# Altium project Multi-Effect_Interface.PrjPcb
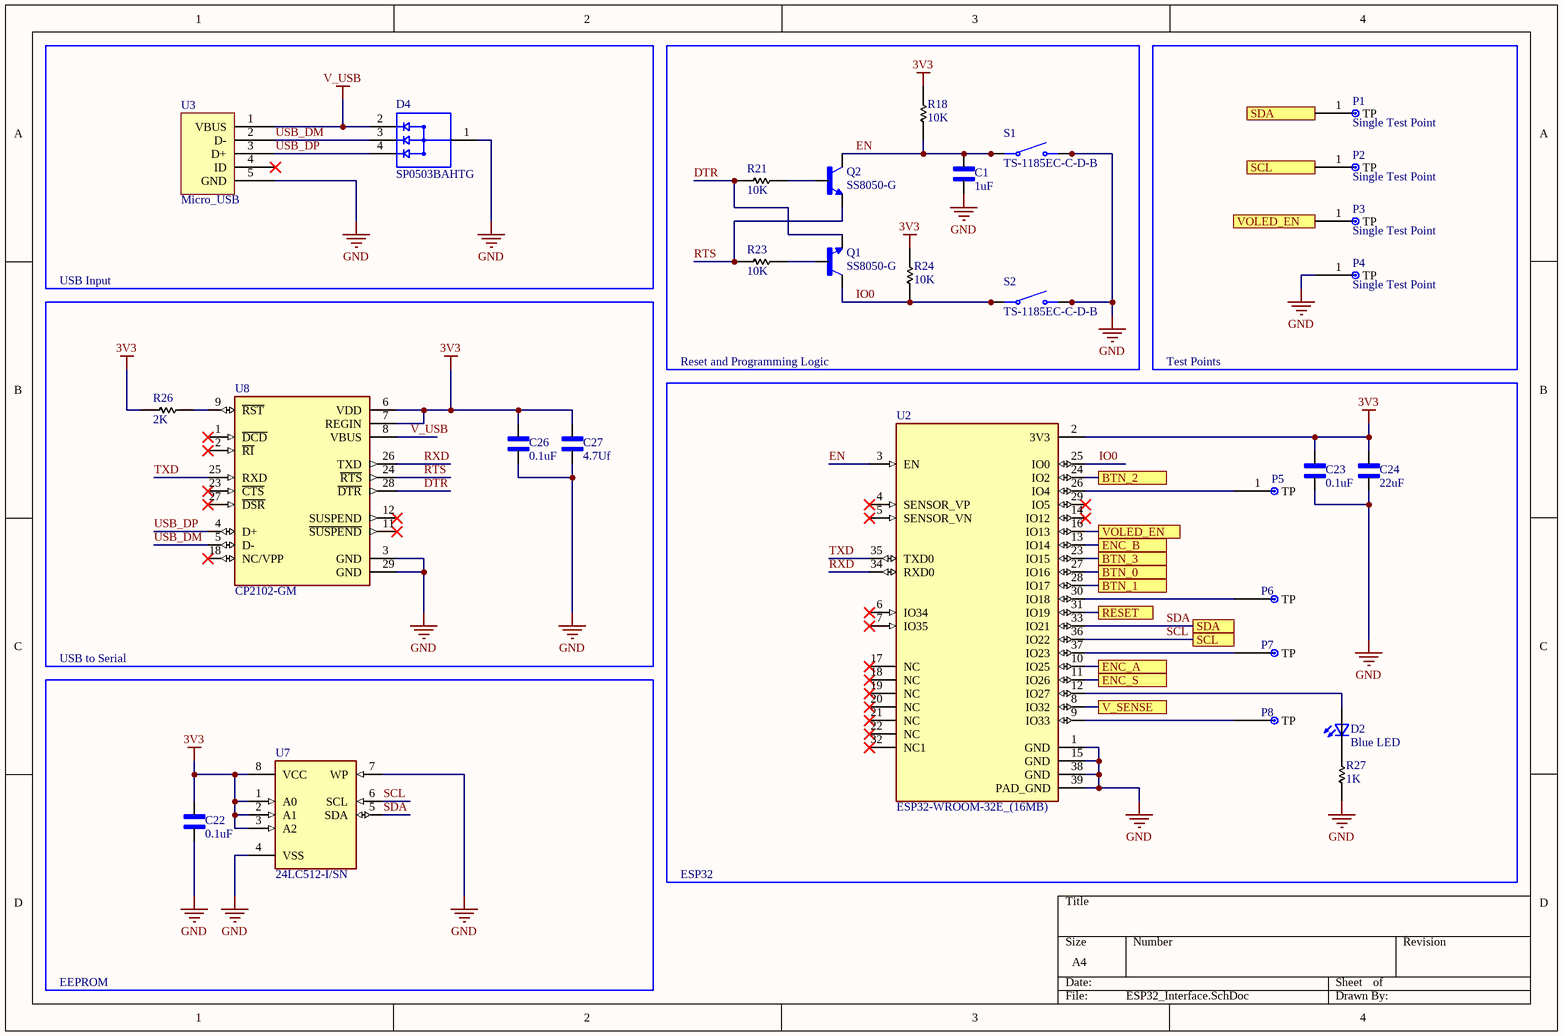
[diagram p0: ESP32_Interface.SchDoc]
4 sheets, 85 parts. Net scope: flat (ports and power ports of the same name join across sheets).
Board file: Interface_PCB.PcbDoc
Sheets:
  ESP32_Interface.SchDoc
  IO.SchDoc
  OLED.SchDoc
  Power.SchDoc

## Sheet ESP32_Interface.SchDoc
size A4; SheetNumber: 1; SheetTotal: 4

### Parts
C1  1uF  [CHIP_0603]
C22  0.1uF  [CHIP_0603]
C23  0.1uF  [CHIP_0603]
C24  22uF  [CHIP_0603]
C26  0.1uF  [CHIP_0603]
C27  4.7Uf  [CHIP_0603]
D2  Blue LED  [0603 LED Generic]
D4  SP0503BAHTG  [SP0503BAHTG]
P1  Single Test Point  [1 Solder Pad]
P2  Single Test Point  [1 Solder Pad]
P3  Single Test Point  [1 Solder Pad]
P4  Single Test Point  [1 Solder Pad]
P5  Single Test Point  [1 Solder Pad]  (value not drawn)
P6  Single Test Point  [1 Solder Pad]  (value not drawn)
P7  Single Test Point  [1 Solder Pad]  (value not drawn)
P8  Single Test Point  [1 Solder Pad]  (value not drawn)
Q1  SS8050-G  [SS8050-G]
Q2  SS8050-G  [SS8050-G]
R18  10K  [CHIP_R_0603]
R21  10K  [CHIP_R_0603]
R23  10K  [CHIP_R_0603]
R24  10K  [CHIP_R_0603]
R26  2K  [CHIP_R_0603]
R27  1K  [CHIP_R_0603]
S1  TS-1185EC-C-D-B  [TS-1185EC-C-D-B]
S2  TS-1185EC-C-D-B  [TS-1185EC-C-D-B]
U2  ESP32-WROOM-32E_(16MB)  [MODULE_ESP32-WROOM-32E]
U3  Micro_USB  [U254-051T-4BH83-F1S]
U7  24LC512-I/SN  [24LC512-I/SN]
U8  CP2102-GM  [QFN50P500X500X100-29N]

### Blocks framed on the sheet
USB Input: D4 U3
Reset and Programming Logic: C1 Q1 Q2 R18 R21 R23 R24 S1 S2
Test Points: P1-P4
USB to Serial: C26 C27 R26 U8
ESP32: C23 C24 D2 P5-P8 R27 U2

### Ports
BTN_0, BTN_1, BTN_2, BTN_3, ENC_A, ENC_B, ENC_S, RESET, SCL, SDA, V_SENSE, VOLED_EN

### Nets
3V3: C22.1 C23.1 C24.1 C26.1 C27.1 R18.1 R24.1 R26.2 U2.2(3V3) U7.1(A0) U7.2(A1) U7.3(A2) U7.8(VCC) U8.6(VDD) U8.7(REGIN)
GND: C1.2 C22.2 C23.2 C24.2 C26.2 C27.2 D4.1 P4.1(TP) R27.2 S1.3(NO) S1.4(NO) S2.3(NO) S2.4(NO) U2.1(GND) U2.15(GND) U2.38(GND) U2.39(PAD_GND) U3.5(GND) U7.4(VSS) U7.7(WP) U8.3(GND) U8.29(GND)
V_USB: D4.2 U3.1(VBUS) U8.8(VBUS)
DTR: Q1.2(E) R21.2 U8.28(~{DTR})
EN: C1.1 Q2.3(C) R18.2 S1.1(COM) S1.2(COM) U2.3(EN)
IO0: Q1.3(C) R24.2 S2.1(COM) S2.2(COM) U2.25(IO0)
RTS: Q2.2(E) R23.2 U8.24(~{RTS})
RXD: U2.34(RXD0) U8.26(TXD)
SCL: P2.1(TP) U2.36(IO22) U7.6(SCL) ; port SCL
SDA: P1.1(TP) U2.33(IO21) U7.5(SDA) ; port SDA
TXD: U2.35(TXD0) U8.25(RXD)
USB_DM: D4.3 U3.2(D-) U8.5(D-)
USB_DP: D4.4 U3.3(D+) U8.4(D+)
NetC2_1: U2.27(IO16) ; port BTN_0
NetC3_1: U2.28(IO17) ; port BTN_1
NetC4_1: U2.11(IO26) ; port ENC_S
NetC5_1: U2.13(IO14) ; port ENC_B
NetC6_1: U2.10(IO25) ; port ENC_A
NetC7_1: U2.24(IO2) ; port BTN_2
NetC8_1: U2.23(IO15) ; port BTN_3
NetD2_1: D2.1(K2) R27.1
NetD2_2: D2.2(A2) U2.12(IO27)
NetJ1_9: U2.31(IO19) ; port RESET
NetP3_1: P3.1(TP) U2.16(IO13) ; port VOLED_EN
NetP5_1: P5.1(TP) U2.26(IO4)
NetP6_1: P6.1(TP) U2.30(IO18)
NetP7_1: P7.1(TP) U2.37(IO23)
NetP8_1: P8.1(TP) U2.9(IO33)
NetQ1_1: Q1.1(B) R23.1
NetQ2_1: Q2.1(B) R21.1
NetR14_2: U2.8(IO32) ; port V_SENSE
NetR26_1: R26.1 U8.9(~{RST})

Not connected (* = marked no-connect by the designer): U2 4(SENSOR_VP)* 5(SENSOR_VN)* 6(IO34)* 7(IO35)* 14(IO12)* 17(NC)* 18(NC)* 19(NC)* 20(NC)* 21(NC)* 22(NC)* 29(IO5)* 32(NC1)*; U3 4(ID)*; U8 1(~{DCD})* 2(~{RI})* 11(~{SUSPEND})* 12(SUSPEND)* 18(NC/VPP)* 23(~{CTS})* 27(~{DSR})*

### Notes on the sheet
- EEPROM

### Library data of the parts
C1 C22-C24 C26 C27 = 0603 Ceramic Capacitor: Generic 0603 Ceramic Capacitor; MP: AC0402FR-071ML; MF: Yageo; Package: 1005 Yageo; SnapEDA_Link: https://www.snapeda.com/parts/AC0402FR-071ML/Yageo/view-part/940461/?ref=snap; Value: *; Mouser-Purchase-URL: https://snapeda.com/shop?store=Mouser&id=940461; DigiKey-Purchase-URL: https://snapeda.com/shop?store=DigiKey&id=940461
D2 = 0603 Generic LED: Value: *
D4 = SP0503BAHTG: 8.5V Clamp Ipp Tvs Diode Surface Mount SOT-143-4; MF: Littelfuse Inc.; MP: SP0503BAHTG; Package: SOT-143 Littelfuse; SnapEDA_Link: https://www.snapeda.com/parts/SP0503BAHTG/Littelfuse%20Inc./view-part/214427/?ref=snap; Digi-Key_Purchase_URL: https://www.digikey.com/product-detail/en/littelfuse-inc/SP0503BAHTG/F2715CT-ND/1154322?utm_source=snapeda&utm_medium=aggregator&utm_campaign=symbol; Value: *; Digi-Key_Part_Number: F2715CT-ND
Q1 Q2 = SS8050-G: NPN TRANSISTOR 1.5A 40V SOT-23 R
R18 R21 R23 R24 R26 R27 = 0603 Generic Resistor: Generic 0603 Resistor
S1 S2 = TS-1185EC-C-D-B: SMD Tactile Switche - 3mm 2mm 50mA 3.65mm SPST 12V
U2 = ESP32-WROOM-32E_(16MB): Bluetooth, WiFi 802.11b/g/n, Bluetooth v4.2 +EDR, Class 1, 2 and 3 Transceiver Module 2.4GHz ~ 2.5GHz Integrated, Trace Surface Mount; MP: ESP32-WROOM-32E (16MB); MF: Espressif Systems; Value: *; SnapEDA_Link: https://www.snapeda.com/parts/ESP32-WROOM-32E%20(16MB)/Espressif%20Systems/view-part/4792564/?ref=snap; Check_prices: https://www.snapeda.com/parts/ESP32-WROOM-32E%20(16MB)/Espressif%20Systems/view-part/4792564/?ref=eda; Availability: Unavailable; Price: None; Package: None
U3 = Micro_USB: XKB Connectivity U254-051T-4BH83-F1S
U7 = 24LC512-I/SN: 512K I2C Serial EEPROM
U8 = CP2102-GM: USB Bridge, USB to UART USB 2.0 UART Interface 28-QFN _5x5_; MF: Silicon Labs; Package: QFN-28 Silicon Labs; Value: *; Price: None; MP: CP2102-GM; Availability: Unavailable; SnapEDA_Link: https://www.snapeda.com/parts/CP2102-GM/Silicon%20Labs/view-part/135876/?ref=snap

## Sheet IO.SchDoc
size A4; SheetNumber: 2; SheetTotal: 4
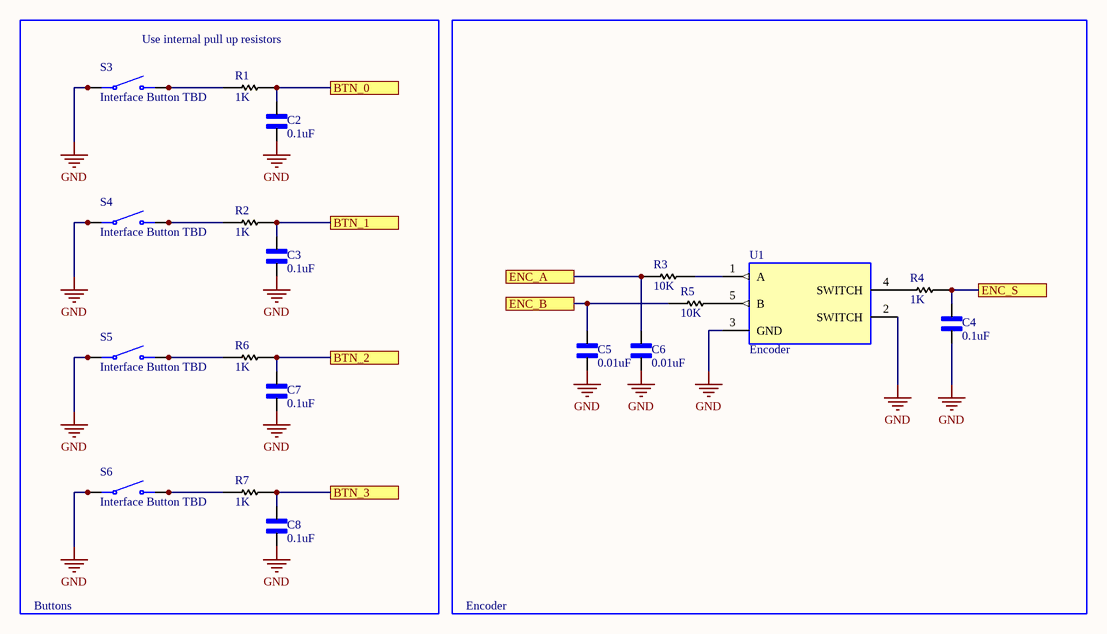
[diagram p1: IO.SchDoc]

### Parts
C2  0.1uF  [CHIP_0603]
C3  0.1uF  [CHIP_0603]
C4  0.1uF  [CHIP_0603]
C5  0.01uF  [CHIP_0603]
C6  0.01uF  [CHIP_0603]
C7  0.1uF  [CHIP_0603]
C8  0.1uF  [CHIP_0603]
R1  1K  [CHIP_R_0603]
R2  1K  [CHIP_R_0603]
R3  10K  [CHIP_R_0603]
R4  1K  [CHIP_R_0603]
R5  10K  [CHIP_R_0603]
R6  1K  [CHIP_R_0603]
R7  1K  [CHIP_R_0603]
S3  Interface Button TBD  [Interface_Button_Multi_Footprint]
S4  Interface Button TBD  [Interface_Button_Multi_Footprint]
S5  Interface Button TBD  [Interface_Button_Multi_Footprint]
S6  Interface Button TBD  [Interface_Button_Multi_Footprint]
U1  Encoder  [Encoder Solder Pads]

### Blocks framed on the sheet
Encoder: C4-C6 R3-R5 U1

### Ports
BTN_0, BTN_1, BTN_2, BTN_3, ENC_A, ENC_B, ENC_S

### Nets
GND: C2.2 C3.2 C4.2 C5.2 C6.2 C7.2 C8.2 S3.1(COM) S3.2(COM) S4.1(COM) S4.2(COM) S5.1(COM) S5.2(COM) S6.1(COM) S6.2(COM) U1.2(SWITCH) U1.3(GND)
NetC2_1: C2.1 R1.1 ; port BTN_0
NetC3_1: C3.1 R2.1 ; port BTN_1
NetC4_1: C4.1 R4.1 ; port ENC_S
NetC5_1: C5.1 R5.2 ; port ENC_B
NetC6_1: C6.1 R3.2 ; port ENC_A
NetC7_1: C7.1 R6.1 ; port BTN_2
NetC8_1: C8.1 R7.1 ; port BTN_3
NetR1_2: R1.2 S3.3(NO) S3.4(NO)
NetR2_2: R2.2 S4.3(NO) S4.4(NO)
NetR3_1: R3.1 U1.1(A)
NetR4_2: R4.2 U1.4(SWITCH)
NetR5_1: R5.1 U1.5(B)
NetR6_2: R6.2 S5.3(NO) S5.4(NO)
NetR7_2: R7.2 S6.3(NO) S6.4(NO)

### Notes on the sheet
- Use internal pull up resistors
- Buttons

### Library data of the parts
C2-C8 = 0603 Ceramic Capacitor: as C1 on sheet ESP32_Interface; Package: 1005 Yageo; SnapEDA_Link: https://www.snapeda.com/parts/AC0402FR-071ML/Yageo/view-part/940461/?ref=snap; Value: *; Mouser-Purchase-URL: https://snapeda.com/shop?store=Mouser&id=940461; DigiKey-Purchase-URL: https://snapeda.com/shop?store=DigiKey&id=940461
R1-R7 = 0603 Generic Resistor: Generic 0603 Resistor
S3-S6 = Interface Button TBD: TBD
U1 = Encoder: Encoder solder connections for PEC11R-4215F-S0024; MF: Diodes Inc.; MP: AP3012KTR-G1; Package: SOT-23-5 Diodes Inc.; Value: *; Availability: Unavailable; SnapEDA_Link: https://www.snapeda.com/parts/AP3012KTR-G1/Diodes%20Inc./view-part/587030/?ref=snap; Price: None

## Sheet OLED.SchDoc
size A4; SheetNumber: 3; SheetTotal: 4
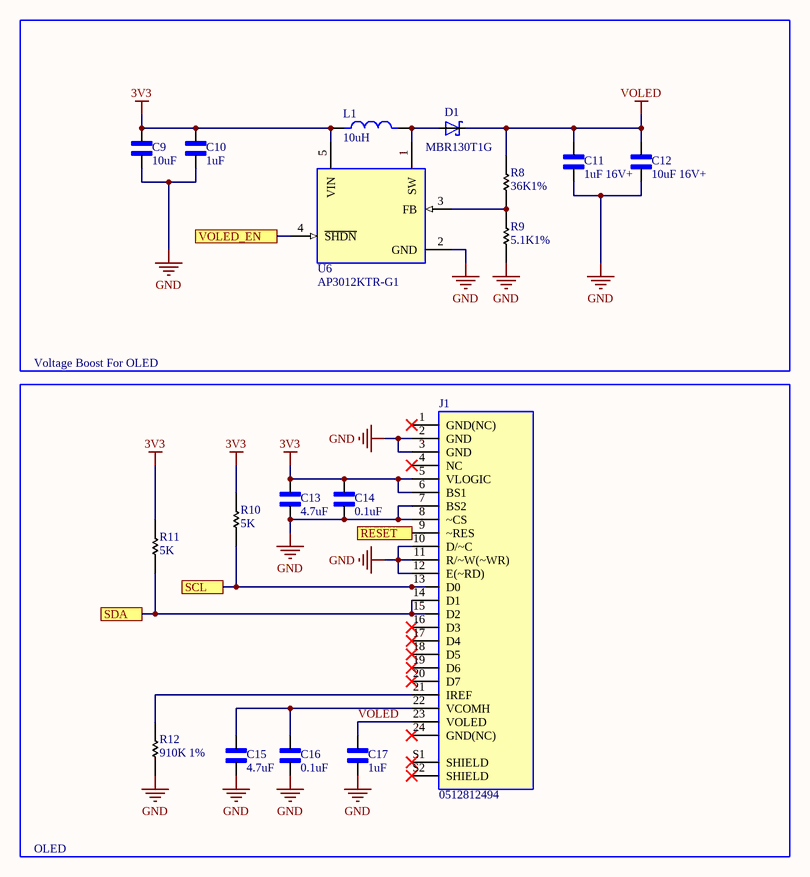
[diagram p2: OLED.SchDoc]

### Parts
C9  10uF  [CHIP_0603]
C10  1uF  [CHIP_0603]
C11  1uF 16V+  [CHIP_0603]
C12  10uF 16V+  [CHIP_0603]
C13  4.7uF  [CHIP_0603]
C14  0.1uF  [CHIP_0603]
C15  4.7uF  [CHIP_0603]
C16  0.1uF  [CHIP_0603]
C17  1uF  [CHIP_0603]
D1  MBR130T1G  [SOD-123-2]
J1  0512812494  [Top_Connector_Config_0512812494]
L1  10uH  [IND_LQH3NPZ100MMEL]
R8  36K1%  [CHIP_R_0603]
R9  5.1K1%  [CHIP_R_0603]
R10  5K  [CHIP_R_0603]
R11  5K  [CHIP_R_0603]
R12  910K 1%  [CHIP_R_0603]
U6  AP3012KTR-G1  [SOT-23]

### Blocks framed on the sheet
Voltage Boost For OLED: C9-C12 D1 L1 R8 R9 U6
OLED: C13-C17 J1 R10-R12

### Ports
RESET, SCL, SDA, VOLED_EN

### Nets
3V3: C9.1 C10.1 C13.1 C14.1 J1.5(VLOGIC) J1.6(BS1) L1.1 R10.1 R11.1 U6.5(VIN)
GND: C9.2 C10.2 C11.2 C12.2 C13.2 C14.2 C15.2 C16.2 C17.2 J1.2(GND) J1.3(GND) J1.7(BS2) J1.8(~CS) J1.10(D/~C) J1.11(R/~W(~WR)) J1.12(E(~RD)) R9.2 R12.2 U6.2(GND)
VOLED: C11.1 C12.1 C17.1 D1.C J1.23(VOLED) R8.1
SCL: J1.13(D0) R10.2 ; port SCL
SDA: J1.14(D1) J1.15(D2) R11.2 ; port SDA
NetC15_1: C15.1 C16.1 J1.22(VCOMH)
NetD1_A: D1.A L1.2 U6.1(SW)
NetJ1_9: J1.9(~RES) ; port RESET
NetJ1_21: J1.21(IREF) R12.1
NetP3_1: U6.4(~{SHDN}) ; port VOLED_EN
NetR8_2: R8.2 R9.1 U6.3(FB)

Not connected (* = marked no-connect by the designer): J1 1(GND(NC))* 4(NC)* 16(D3)* 17(D4)* 18(D5)* 19(D6)* 20(D7)* 24(GND(NC))* S1(SHIELD)* S2(SHIELD)*

### Library data of the parts
C9-C17 = 0603 Ceramic Capacitor: as C1 on sheet ESP32_Interface; Package: 1005 Yageo; SnapEDA_Link: https://www.snapeda.com/parts/AC0402FR-071ML/Yageo/view-part/940461/?ref=snap; Value: *; Mouser-Purchase-URL: https://snapeda.com/shop?store=Mouser&id=940461; DigiKey-Purchase-URL: https://snapeda.com/shop?store=DigiKey&id=940461
D1 = MBR130T1G: Diode Schottky 30 V 1A Surface Mount SOD-123; MP: MBR0530; MF: ON Semiconductor; Arrow_Electronics-Purchase-URL: https://snapeda.com/shop?store=Arrow+Electronics&id=2580921; Price: None; Package: SOD-123 Diodes Inc.; Value: *; DigiKey-Purchase-URL: https://snapeda.com/shop?store=DigiKey&id=2580921; Availability: Good; Mouser-Purchase-URL: https://snapeda.com/shop?store=Mouser&id=2580921; SnapEDA_Link: https://www.snapeda.com/parts/MBR0530/ON%20Semiconductor/view-part/2580921/?ref=snap
J1 = 0512812494: 24 Position FFC, FPC Connector Contacts, Top and Bottom 0.020" (0.50mm) Surface Mount, Right Angle; MP: 2-84952-4; MF: TE Connectivity; Package: None; EU_RoHS_Compliance: Compliant; Availability: Unavailable; Price: None; Value: *; SnapEDA_Link: https://www.snapeda.com/parts/2-84952-4/TE%20Connectivity/view-part/1466414/?ref=snap
L1 = LQH3NPZ100MMEL: Inductor with Inductance: 10uH Tol. +/-20%, Package: 1212 _3030_; MF: Murata; Package: 1212 Murata; MP: LQH3NPZ100MMEL; Digi-Key_Purchase_URL: https://www.digikey.com/product-detail/en/murata-electronics/LQH3NPZ100MMEL/490-15968-1-ND/6800633?utm_source=snapeda&utm_medium=aggregator&utm_campaign=symbol; Digi-Key_Part_Number: 490-15968-1-ND; Value: *; SnapEDA_Link: https://www.snapeda.com/parts/LQH3NPZ100MMEL/Murata/view-part/4547346/?ref=snap
R8-R12 = 0603 Generic Resistor: Generic 0603 Resistor
U6 = AP3012KTR-G1: Boost Switching Regulator IC Positive Adjustable 1.25V 1 Output 500mA _Switch_ SC-74A, SOT-753; MF: Diodes Inc.; Package: SOT-23-5 Diodes Inc.; MP: AP3012KTR-G1; Value: *; Availability: Unavailable; SnapEDA_Link: https://www.snapeda.com/parts/AP3012KTR-G1/Diodes%20Inc./view-part/587030/?ref=snap; Price: None

## Sheet Power.SchDoc
size A4; SheetNumber: 4; SheetTotal: 4
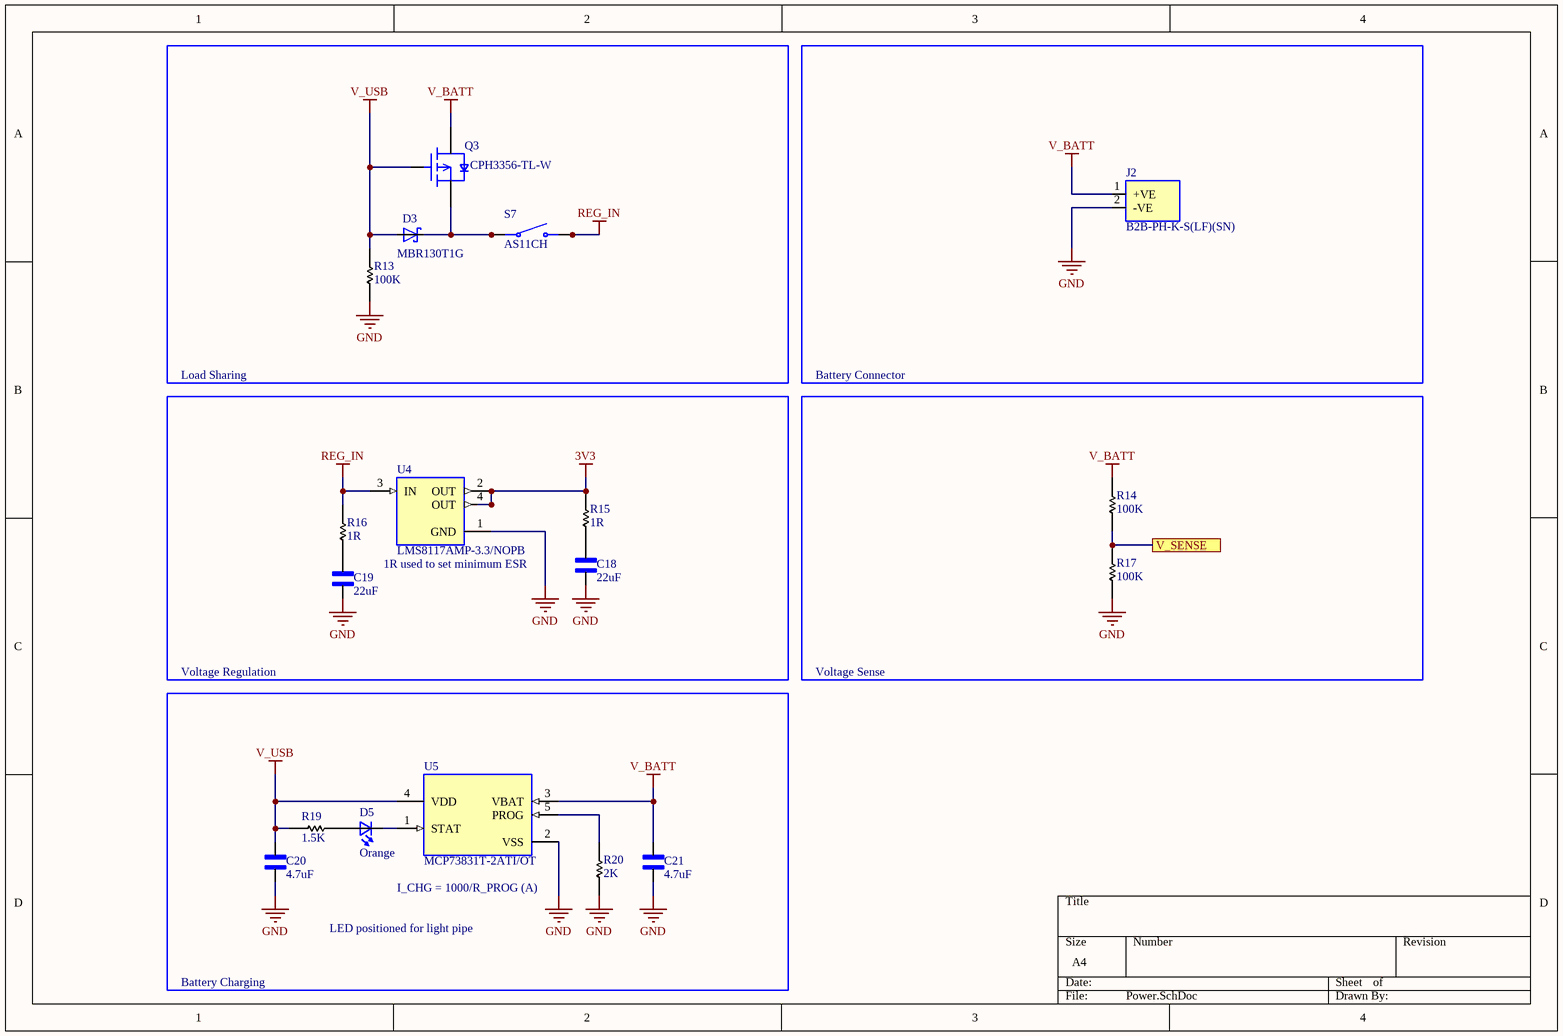
[diagram p3: Power.SchDoc]

### Parts
C18  22uF  [CHIP_0603]
C19  22uF  [CHIP_0603]
C20  4.7uF  [CHIP_0603]
C21  4.7uF  [CHIP_0603]
D3  MBR130T1G  [SOD-123-2]
D5  Orange  [0603 LED Generic]
J2  B2B-PH-K-S(LF)(SN)  [JST_B2B-PH-K-S(LF)(SN)]
Q3  CPH3356-TL-W  [SOT23-3]
R13  100K  [CHIP_R_0603]
R14  100K  [CHIP_R_0603]
R15  1R  [CHIP_R_0603]
R16  1R  [CHIP_R_0603]
R17  100K  [CHIP_R_0603]
R19  1.5K  [CHIP_R_0603]
R20  2K  [CHIP_R_0603]
S7  AS11CH  [AS11CH]
U4  LMS8117AMP-3.3/NOPB  [SOT230P700X180-4N]
U5  MCP73831T-2ATI/OT  [SOT95P280X145-5N]

### Blocks framed on the sheet
Load Sharing: D3 Q3 R13 S7
Battery Connector: J2

### Ports
V_SENSE

### Nets
3V3: R15.1 U4.2(OUT) U4.4(OUT)
GND: C18.2 C19.2 C20.2 C21.2 J2.2(-VE) R13.2 R17.2 R20.2 U4.1(GND) U5.2(VSS)
REG_IN: R16.1 S7.1 S7.3(NO) U4.3(IN)
V_BATT: C21.1 J2.1(+VE) Q3.3(D) R14.1 U5.3(VBAT)
V_USB: C20.1 D3.A Q3.1(G) R13.1 R19.1 U5.4(VDD)
NetC18_1: C18.1 R15.2
NetC19_1: C19.1 R16.2
NetD3_C: D3.C Q3.2(S) S7.1(COM) S7.3
NetD5_1: D5.1(K2) U5.1(STAT)
NetD5_2: D5.2(A2) R19.2
NetR14_2: R14.2 R17.1 ; port V_SENSE
NetR20_1: R20.1 U5.5(PROG)

### Notes on the sheet
- 1R used to set minimum ESR
- Voltage Regulation
- Voltage Sense
- I_CHG = 1000/R_PROG (A)
- Battery Charging
- LED positioned for light pipe

### Library data of the parts
C18-C21 = 0603 Ceramic Capacitor: as C1 on sheet ESP32_Interface; Package: 1005 Yageo; SnapEDA_Link: https://www.snapeda.com/parts/AC0402FR-071ML/Yageo/view-part/940461/?ref=snap; Value: *; Mouser-Purchase-URL: https://snapeda.com/shop?store=Mouser&id=940461; DigiKey-Purchase-URL: https://snapeda.com/shop?store=DigiKey&id=940461
D3 = MBR130T1G: as D1 on sheet OLED; Arrow_Electronics-Purchase-URL: https://snapeda.com/shop?store=Arrow+Electronics&id=2580921; Price: None; Package: SOD-123 Diodes Inc.; Value: *; DigiKey-Purchase-URL: https://snapeda.com/shop?store=DigiKey&id=2580921; Availability: Good; Mouser-Purchase-URL: https://snapeda.com/shop?store=Mouser&id=2580921; SnapEDA_Link: https://www.snapeda.com/parts/MBR0530/ON%20Semiconductor/view-part/2580921/?ref=snap
D5 = 0603 Generic LED: Value: *
J2 = B2B-PH-K-S(LF)(SN): Connector Header Through Hole 2 position 0.079" (2.00mm); MP: S2B-PH-SM4-TB_LF__SN_; MF: JST Sales; SnapEDA_Link: https://www.snapeda.com/parts/S2B-PH-SM4-TB%28LF%29%28SN%29/JST%20Sales%20America%20Inc./view-part/46879/?ref=snap; Package: None; Digi-Key_Part_Number: 455-1749-1-ND; Digi-Key_Purchase_URL: https://www.digikey.com.au/product-detail/en/jst-sales-america-inc/S2B-PH-SM4-TB_LF__SN_/455-1749-1-ND/926846?utm_source=snapeda&utm_medium=aggregator&utm_campaign=symbol; Value: *
Q3 = CPH3356-TL-W: P-Channel 20 V 2.5A (Ta) 1W (Ta) Surface Mount 3-CPH
R13-R17 R19 R20 = 0603 Generic Resistor: Generic 0603 Resistor
S7 = AS11CH: SWITCH SLIDE SPST 0.4VA 28V
U4 = LMS8117AMP-3.3/NOPB: Fixed 3.3V LDO 1A 15V input SOT-223; MF: Texas Instruments; SnapEDA_Link: https://www.snapeda.com/parts/LMS8117AMP-3.3/NOPB/Texas%20Instruments/view-part/104396/?ref=snap; Price: None; Check_prices: https://www.snapeda.com/parts/LMS8117AMP-3.3/NOPB/Texas%20Instruments/view-part/104396/?ref=eda; Purchase-URL: https://pricing.snapeda.com/search/part/LMS8117AMP-3.3/NOPB/?ref=eda; Value: *; MP: LMS8117AMP-3.3/NOPB; Package: SOT-223-4 Texas Instruments; Availability: Warning
U5 = MCP73831T-2ATI/OT: Charger IC Lithium Ion/Polymer SOT-23-5; MF: Microchip; Availability: Unavailable; SnapEDA_Link: https://www.snapeda.com/parts/MCP73831T-2ATI/OT/Microchip/view-part/51423/?ref=snap; Price: None; MP: MCP73831T-2ATI/OT; Arrow_Americas-Purchase-URL: https://snapeda.com/shop?store=Arrow+Americas&id=51423; Package: SOT-23 Microchip; DigiKey-Purchase-URL: https://snapeda.com/shop?store=DigiKey&id=51423; Value: *; Mouser-Purchase-URL: https://snapeda.com/shop?store=Mouser&id=51423

## Nets that join several sheets
3V3: ESP32_Interface (15 pins), OLED (10 pins), Power (R15.1 U4.2 U4.4)
GND: ESP32_Interface (22 pins), IO (17 pins), OLED (19 pins), Power (10 pins)
V_USB: ESP32_Interface (D4.2 U3.1 U8.8), Power (6 pins)
NetC2_1: ESP32_Interface (U2.27), IO (C2.1 R1.1)
NetC3_1: ESP32_Interface (U2.28), IO (C3.1 R2.1)
NetC4_1: ESP32_Interface (U2.11), IO (C4.1 R4.1)
NetC5_1: ESP32_Interface (U2.13), IO (C5.1 R5.2)
NetC6_1: ESP32_Interface (U2.10), IO (C6.1 R3.2)
NetC7_1: ESP32_Interface (U2.24), IO (C7.1 R6.1)
NetC8_1: ESP32_Interface (U2.23), IO (C8.1 R7.1)
NetJ1_9: ESP32_Interface (U2.31), OLED (J1.9)
NetP3_1: ESP32_Interface (P3.1 U2.16), OLED (U6.4)
NetR14_2: ESP32_Interface (U2.8), Power (R14.2 R17.1)
SCL: ESP32_Interface (P2.1 U2.36 U7.6), OLED (J1.13 R10.2)
SDA: ESP32_Interface (P1.1 U2.33 U7.5), OLED (J1.14 J1.15 R11.2)